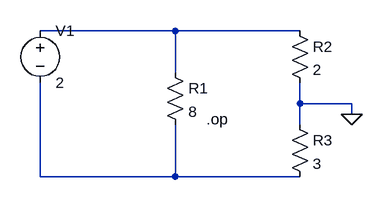
[diagram p0: schematic paralleltoVoltage.asc]
paralleltoVoltage.asc, the LTspice schematic file:
Version 4
SHEET 1 992 680
WIRE 704 224 496 224
WIRE 896 224 704 224
WIRE 704 288 704 224
WIRE 496 448 496 304
WIRE 896 336 896 304
WIRE 976 336 896 336
WIRE 976 352 976 336
WIRE 896 368 896 336
WIRE 704 448 704 368
WIRE 704 448 496 448
WIRE 896 448 704 448
FLAG 976 352 0
SYMBOL res 688 272 R0
SYMATTR InstName R1
SYMATTR Value 8
SYMBOL res 880 208 R0
SYMATTR InstName R2
SYMATTR Value 2
SYMBOL res 880 352 R0
SYMATTR InstName R3
SYMATTR Value 3
SYMBOL voltage 496 208 R0
SYMATTR InstName V1
SYMATTR Value 2
TEXT 752 360 Left 2 !.op

The netlist it stands for:
* paralleltoVoltage.asc
R1 N001 N002 8
R2 N001 0 2
R3 0 N002 3
V1 N001 N002 2
.op
.backanno
.end